# EAGLE design MIX0401_Main (EAGLE 8.7.1)
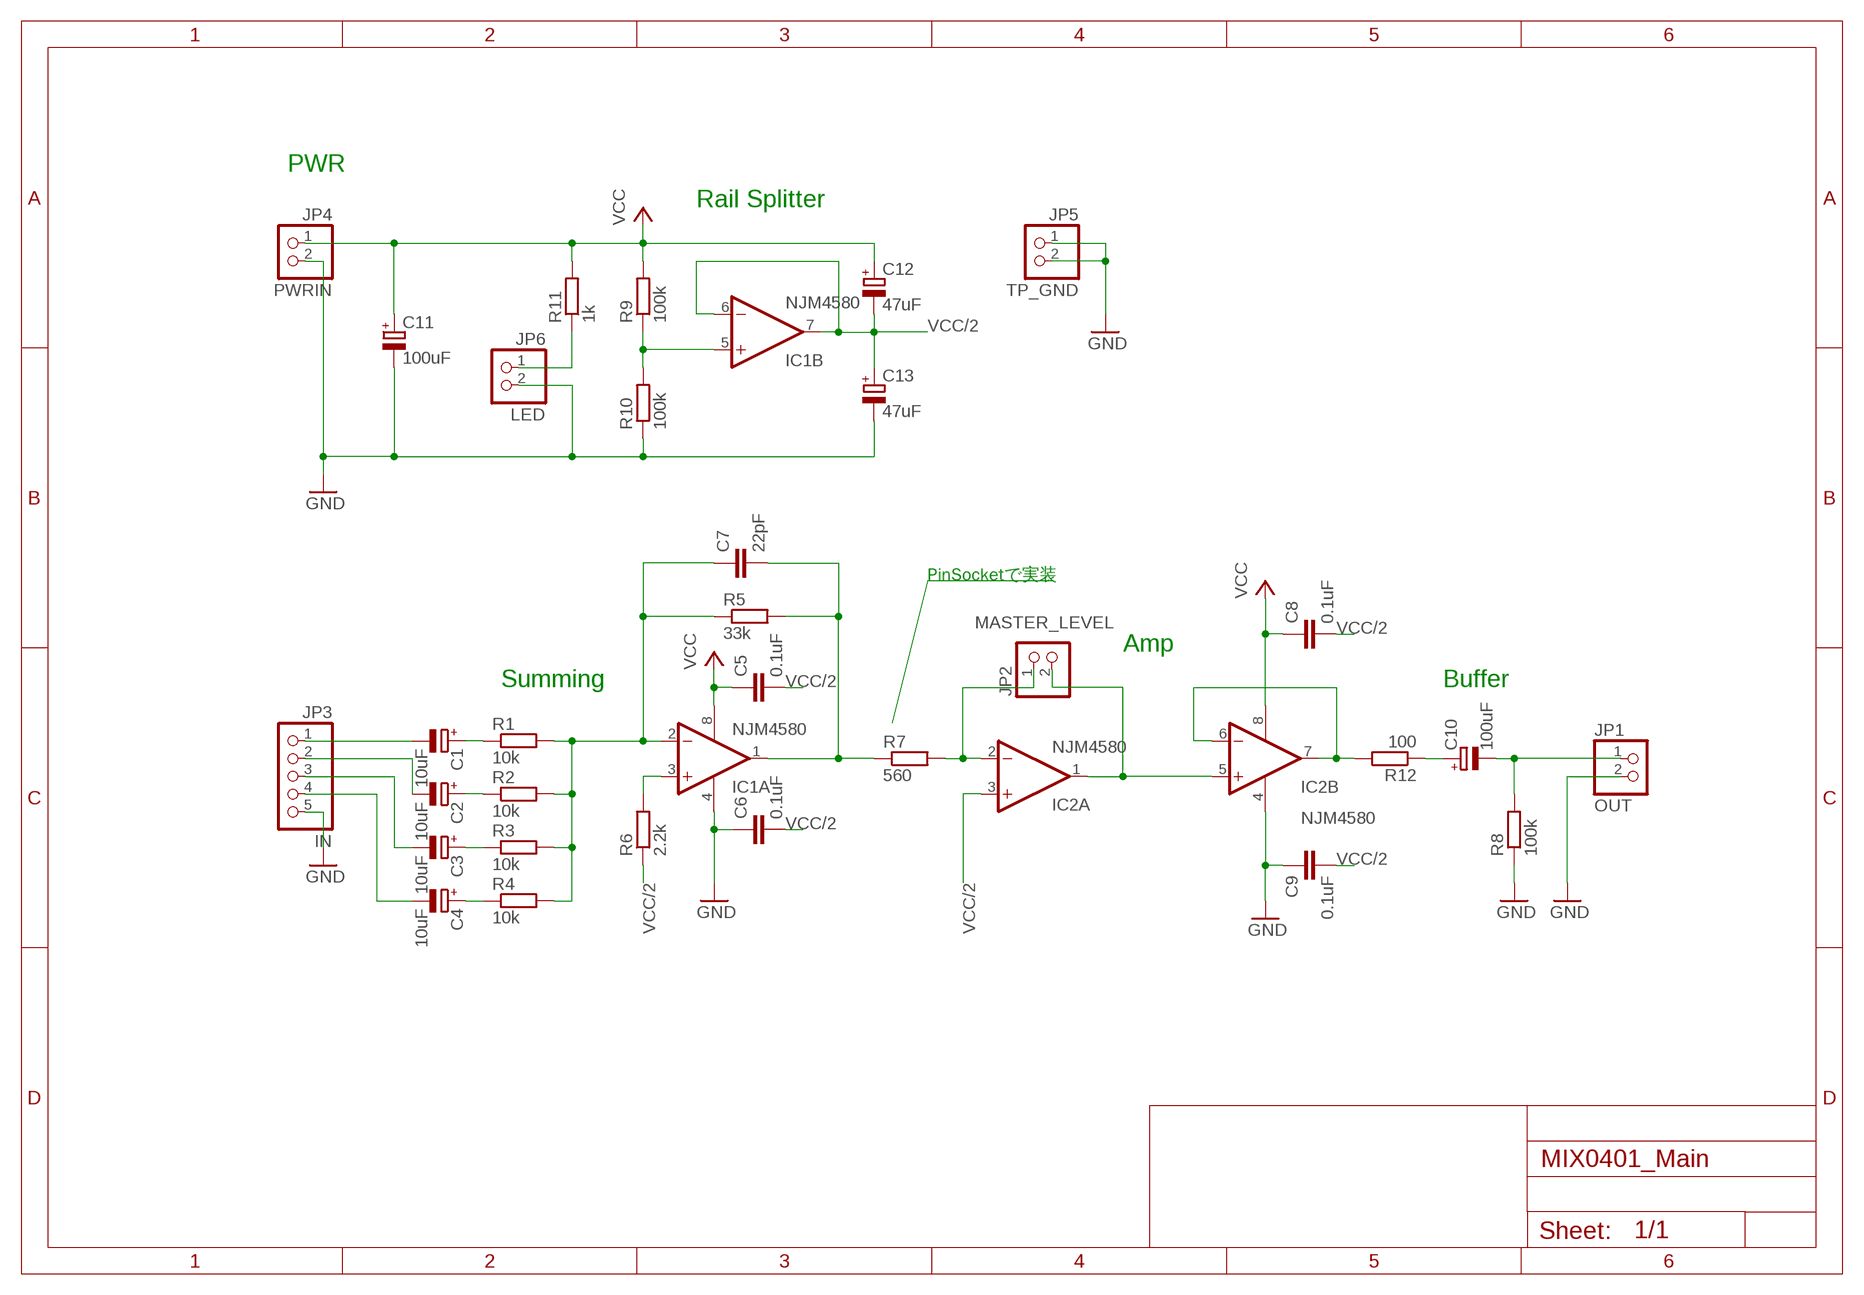
[diagram p0: schematic, sheet 1]

## Parts
C1  10uF  CPOL-EUE2.5-5  [E2,5-5]
C2  10uF  CPOL-EUE2.5-5  [E2,5-5]
C3  10uF  CPOL-EUE2.5-5  [E2,5-5]
C4  10uF  CPOL-EUE2.5-5  [E2,5-5]
C5  0.1uF  C-EU025-024X044  [C025-024X044]
C6  0.1uF  C-EU025-024X044  [C025-024X044]
C7  22pF  C-EU050-024X044  [C050-024X044]
C8  0.1uF  C-EU025-024X044  [C025-024X044]
C9  0.1uF  C-EU025-024X044  [C025-024X044]
C10  100uF  CPOL-EUE2.5-7  [E2,5-7]
C11  100uF  CPOL-EUE2.5-7  [E2,5-7]
C12  47uF  CPOL-EUE2.5-6  [E2,5-6]
C13  47uF  CPOL-EUE2.5-6  [E2,5-6]
IC1  NJM4580  LM4558N  [DIL08]
IC2  NJM4580  LM4558N  [DIL08]
JP1  OUT  PINHD-1X2  [1X02]
JP2  MASTER_LEVEL  PINHD-1X2  [1X02]
JP3  IN  PINHD-1X5  [1X05]
JP4  PWRIN  PINHD-1X2  [1X02]
JP5  TP_GND  PINHD-1X2  [1X02]
JP6  LED  PINHD-1X2  [1X02]
R1  10k  R-EU_0207/7  [0207/7]
R2  10k  R-EU_0207/7  [0207/7]
R3  10k  R-EU_0207/7  [0207/7]
R4  10k  R-EU_0207/7  [0207/7]
R5  33k  R-EU_0207/7  [0207/7]
R6  2.2k  R-EU_0207/7  [0207/7]
R7  560  R-EU_0207/7  [0207/7]
R8  100k  R-EU_0207/7  [0207/7]
R9  100k  R-EU_0207/7  [0207/7]
R10  100k  R-EU_0207/7  [0207/7]
R11  1k  R-EU_0207/7  [0207/7]
R12  100  R-EU_0207/7  [0207/7]

## Nets
GND: C6.1 C9.1 C11.- C13.- IC1.4(P:V-) IC2.4(P:V-) JP1.2 JP3.5 JP4.2 JP5.1 JP5.2 JP6.2 R8.1 R10.1
N$1: C7.1 IC1.2(A:-IN) R1.2 R2.2 R3.2 R4.2 R5.1
N$2: C1.- JP3.1
N$3: IC1.3(A:+IN) R6.2
N$4: IC2.2(A:-IN) JP2.1 R7.2
N$5: C1.+ R1.1
N$6: C7.2 IC1.1(A:OUT) R5.2 R7.1
N$7: C2.+ R2.1
N$8: C3.+ R3.1
N$9: C4.+ R4.1
N$10: C10.- JP1.1 R8.2
N$11: IC1.5(B:+IN) R9.1 R10.2
N$12: IC2.6(B:-IN) IC2.7(B:OUT) R12.2
N$13: IC2.1(A:OUT) IC2.5(B:+IN) JP2.2
N$14: C2.- JP3.2
N$15: C3.- JP3.3
N$16: C4.- JP3.4
N$17: JP6.1 R11.1
N$19: C10.+ R12.1
VCC: C5.1 C8.1 C11.+ C12.+ IC1.8(P:V+) IC2.8(P:V+) JP4.1 R9.2 R11.2
VCC/2: C5.2 C6.2 C8.2 C9.2 C12.- C13.+ IC1.6(B:-IN) IC1.7(B:OUT) IC2.3(A:+IN) R6.1

## Notes on the sheet
- PWR
- Rail Splitter
- PinSocketで実装
- Amp
- Summing | Buffer

## Library data of the parts
C1-C4 C10-C13 = rcl:CPOL-EU: POLARIZED CAPACITOR, European symbol; SPICEPREFIX: C
C5-C9 = rcl:C-EU: CAPACITOR, European symbol; SPICEPREFIX: C
IC1 IC2 = linear:*4558: OP AMP
JP1 JP2 JP4-JP6 = pinhead:PINHD-1X2: PIN HEADER
JP3 = pinhead:PINHD-1X5: PIN HEADER
R1-R12 = rcl:R-EU_: RESISTOR, European symbol; SPICEPREFIX: R

## Board
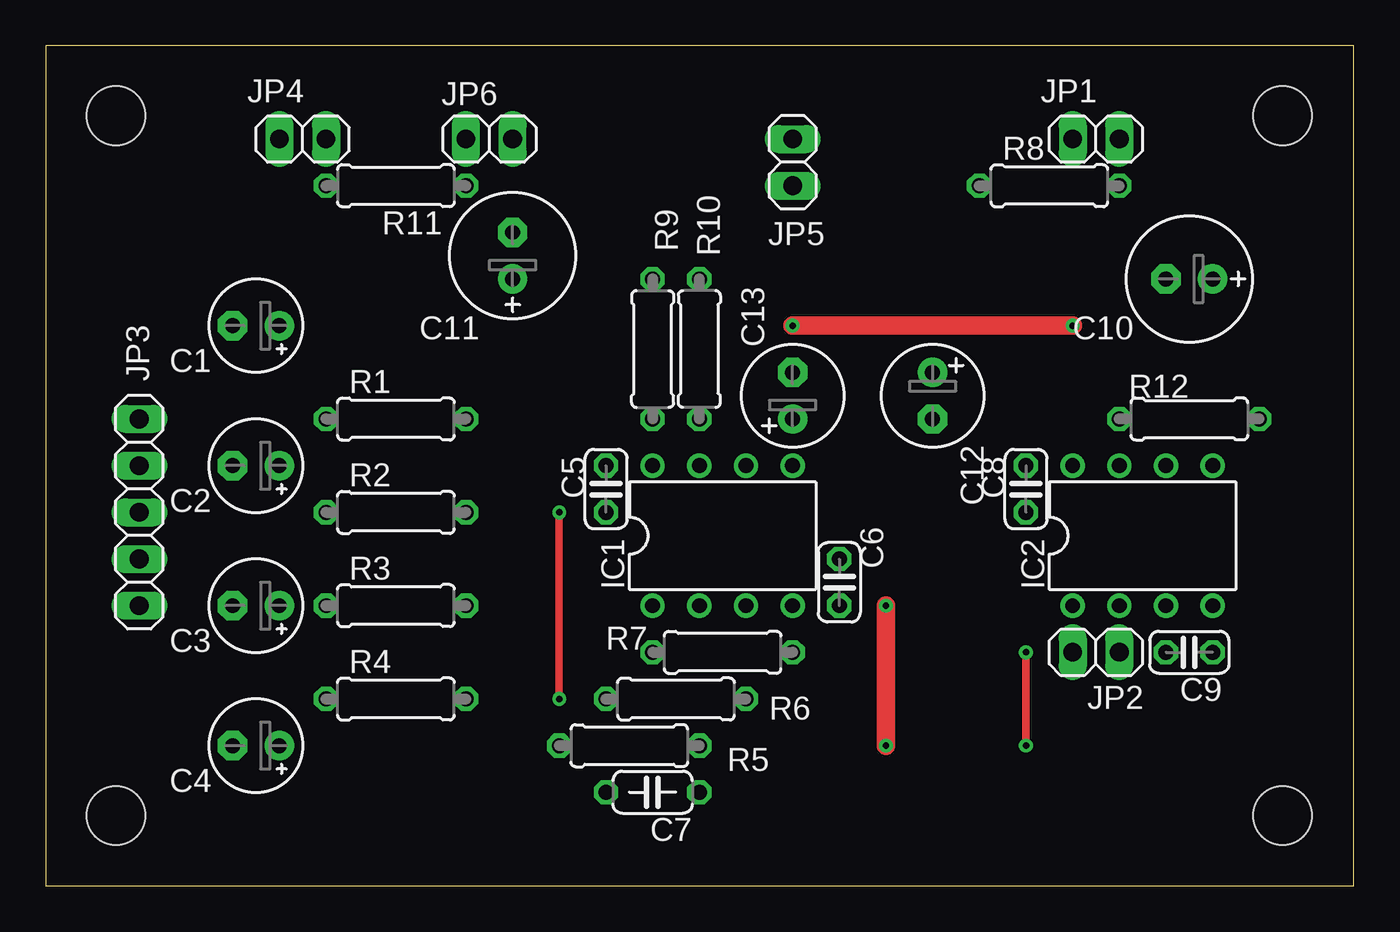
[diagram p1: board, top side]
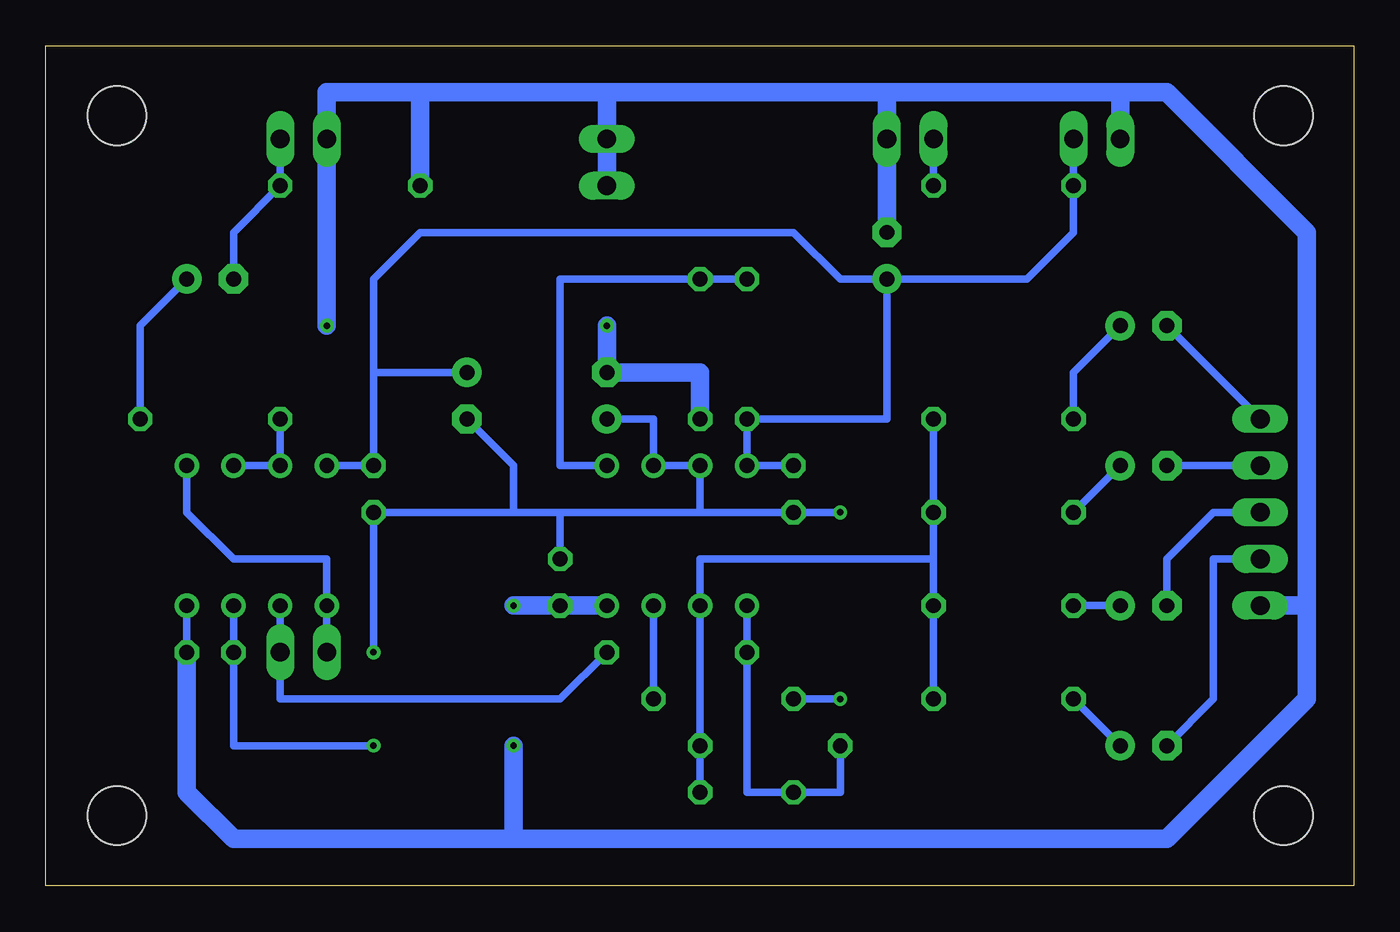
[diagram p2: board, bottom side, seen from below]

Size 71.17 x 45.71 mm. Coordinates in mm from the lower left corner, seen from the top.
Outline: 0,0 71.17,0 71.17,45.71 0,45.71 0,0
Copper layers (1*16): Top 0.035mm / dielectric 1.5mm / Bottom 0.035mm
Design rules "default": minimum track width 6mil, minimum drill 0.35mm, track to track 6mil, track to pad 6mil, pad to pad 6mil, via to via 6mil, smd to smd 6mil, copper to edge 40mil, drill to drill 6mil, minimum pad ring 10mil, minimum via ring 8mil, stop-mask expansion 4mil, vias tented up to drill 0mil, thermal gap 10mil
Holes 3.2 mm at 3.81,3.81 3.81,41.91 67.31,41.91 67.31,3.81

### Footprints (pad centres in the part's own frame; a part is rotated, then mirrored left to right if it is on the bottom)
E2,5-5 = drill 0.813 pad 1.6: + -1.27,0 | drill 0.813 pad 1.6 octagon: - 1.27,0
C025-024X044 = drill 0.813 octagon: 1 -1.27,0; 2 1.27,0
C050-024X044 = drill 0.813 octagon: 1 -2.54,0; 2 2.54,0
E2,5-7 = drill 0.813 pad 1.6: + -1.27,0 | drill 0.813 pad 1.6 octagon: - 1.27,0
E2,5-6 = drill 0.813 pad 1.6: + -1.27,0 | drill 0.813 pad 1.6 octagon: - 1.27,0
DIL08 = drill 0.813 pad 1.27: 1 -3.81,-3.81; 2 -1.27,-3.81; 3 1.27,-3.81; 4 3.81,-3.81; 5 3.81,3.81; 6 1.27,3.81; 7 -1.27,3.81; 8 -3.81,3.81
1X02 = drill 1.016 long: 1 -1.27,0; 2 1.27,0
1X05 = drill 1.016 long: 1 -5.08,0; 2 -2.54,0; 3 0,0; 4 2.54,0; 5 5.08,0
0207/7 = drill 0.813 octagon: 1 -3.81,0; 2 3.81,0

### Placement (x,y rotation side)
C1  11.43,30.48 180 top
C2  11.43,22.86 180 top
C3  11.43,15.24 180 top
C4  11.43,7.62 180 top
C5  30.48,21.59 270 top
C6  43.18,16.51 90 top
C7  33.02,5.08 180 top
C8  53.34,21.59 270 top
C9  62.23,12.7 180 top
C10  62.23,33.02 180 top
C11  25.4,34.29 90 top
C12  48.26,26.67 270 top
C13  40.64,26.67 90 top
IC1  36.83,19.05 0 top
IC2  59.69,19.05 0 top
JP1  57.15,40.64 180 top
JP2  57.15,12.7 180 top
JP3  5.08,20.32 270 top
JP4  13.97,40.64 180 top
JP5  40.64,39.37 270 top
JP6  24.13,40.64 0 top
R1  19.05,25.4 0 top
R2  19.05,20.32 0 top
R3  19.05,15.24 0 top
R4  19.05,10.16 0 top
R5  31.75,7.62 180 top
R6  34.29,10.16 0 top
R7  36.83,12.7 0 top
R8  54.61,38.1 0 top
R9  33.02,29.21 270 top
R10  35.56,29.21 90 top
R11  19.05,38.1 180 top
R12  62.23,25.4 180 top

### Tracks (layer width: path | path; a pad name or v marks a point on that pad's centre or on a via)
GND  (via drill 0.35)
  Top 1.016: v55.88,30.48 v40.64,30.48 | v45.72,15.24 v45.72,7.62
  Bottom 0.406: IC2.4 C9.1
  Bottom 1.016: JP3.5 2.54,15.24 | 2.54,15.24 2.54,35.56 10.16,43.18 12.7,43.18 | 45.72,2.54 60.96,2.54 63.5,5.08 C9.1 | 45.72,2.54 10.16,2.54 2.54,10.16 2.54,15.24 | 12.7,43.18 25.4,43.18 | 25.4,43.18 JP6.2 C11.- | JP4.2 12.7,43.18 | v40.64,30.48 C13.- 35.56,27.94 R10.1 | IC1.4 C6.1 v45.72,15.24 | v45.72,7.62 45.72,2.54 | 25.4,43.18 40.64,43.18 | 40.64,43.18 50.8,43.18 | v55.88,30.48 JP1.2 55.88,43.18 50.8,43.18 | R8.1 50.8,43.18 | 40.64,43.18 JP5.1 JP5.2
N$1
  Bottom 0.406: C7.1 R5.1 IC1.2 35.56,17.78 22.86,17.78 | R1.2 R2.2 22.86,17.78 | 22.86,17.78 R3.2 R4.2
N$2
  Bottom 0.406: JP3.1 C1.-
N$3
  Bottom 0.406: IC1.3 R6.2
N$4
  Bottom 0.406: R7.2 43.18,10.16 58.42,10.16 JP2.1 IC2.2
N$5
  Bottom 0.406: R1.1 15.24,27.94 C1.+
N$6
  Bottom 0.406: IC1.1 R7.1 33.02,5.08 C7.2 27.94,5.08 R5.2
N$7
  Bottom 0.406: C2.+ R2.1
N$8
  Bottom 0.406: C3.+ R3.1
N$9
  Bottom 0.406: C4.+ R4.1
N$10
  Bottom 0.406: JP1.1 R8.2 60.96,35.56 C10.-
N$11
  Bottom 0.406: R9.1 R10.2 43.18,33.02 43.18,22.86 IC1.5
N$12
  Bottom 0.406: IC2.6 IC2.7 R12.2
N$13
  Bottom 0.406: JP2.2 IC2.1 55.88,17.78 60.96,17.78 63.5,20.32 IC2.5
N$14
  Bottom 0.406: JP3.2 C2.-
N$15
  Bottom 0.406: JP3.3 7.62,20.32 10.16,17.78 C3.-
N$16
  Bottom 0.406: JP3.4 7.62,17.78 7.62,10.16 C4.-
N$17
  Bottom 0.406: JP6.1 R11.1
N$19
  Bottom 0.406: R12.1 66.04,30.48 C10.+
VCC
  Bottom 0.406: C5.1 IC1.8 R9.2 25.4,25.4 C11.+ | JP4.1 R11.2 15.24,35.56 17.78,33.02 C11.+ | C11.+ 27.94,33.02 30.48,35.56 50.8,35.56 53.34,33.02 53.34,27.94 | 53.34,27.94 C8.1 IC2.8 | C12.+ 53.34,27.94
VCC/2  (via drill 0.35)
  Top 0.406: v27.94,10.16 v27.94,20.32 | v53.34,12.7 v53.34,7.62
  Bottom 0.406: 35.56,20.32 C5.2 v27.94,20.32 | 35.56,20.32 43.18,20.32 | 43.18,20.32 45.72,20.32 | 45.72,20.32 C8.2 v53.34,12.7 | R6.1 v27.94,10.16 | 35.56,20.32 IC1.7 IC1.6 38.1,25.4 C13.+ | IC2.3 C9.2 60.96,7.62 v53.34,7.62 | C6.2 43.18,20.32 | C12.- 45.72,22.86 45.72,20.32

### Text on the board
tDocu: MIX0401 | http://dad8893.blogspot.jp/